# Altium schematic sheet Voeding.SchDoc
size A4; SheetNumber: 5; SheetTotal: 5
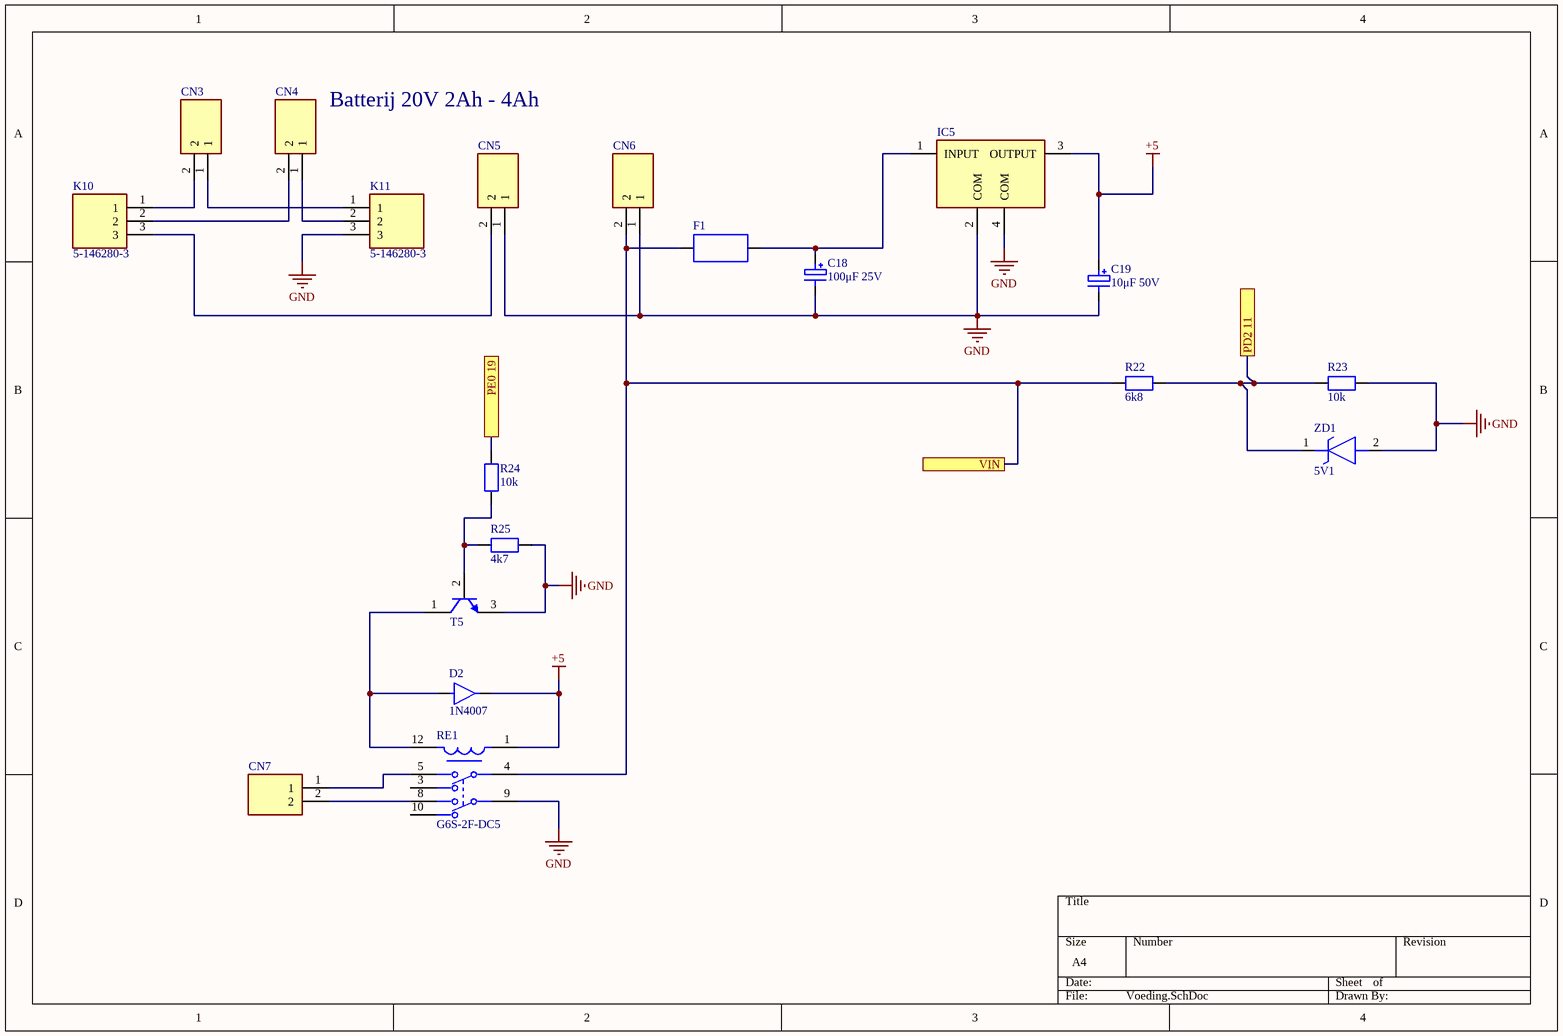
[diagram p0: Voeding.SchDoc]

## Parts
C18  100μF 25V  [Elco 100uF 25V]
C19  10μF 50V  [Elco 100uF 25V]
CN3  282836-2  [Schroefconnector 2 Pin]  (value not drawn)
CN4  282836-2  [Schroefconnector 2 Pin]  (value not drawn)
CN5  282836-2  [Schroefconnector 2 Pin]  (value not drawn)
CN6  282836-2  [Schroefconnector 2 Pin]  (value not drawn)
CN7  282836-2  [Schroefconnector 2 Pin]  (value not drawn)
D2  1N4007  [1N4007]
F1  696101000002  [FuseHolder]  (value not drawn)
IC5  TL780-05CKTTR  [DC-DC Convertor]  (value not drawn)
K10  5-146280-3  [3 Pin Header]
K11  5-146280-3  [3 Pin Header]
R22  6k8  [Resistor]
R23  10k  [Resistor]
R24  10k  [Resistor]
R25  4k7  [Resistor]
RE1  G6S-2F-DC5  [Relay]
T5  BC547CZL1G  [BC547C]  (value not drawn)
ZD1  5V1  [ZenerDiode]

## Ports
PD2 11 (see CPU[3B]), PE0 19 (see CPU[1B]), VIN (see Regelaar[2A])

## Nets
+5: C19.1 D2.1(C) IC5.3(OUTPUT) RE1.1
GND: C18.2 C19.2 CN5.1 CN6.1 IC5.2(COM) IC5.4(COM) K11.3 R23.2 R25.2 RE1.9 T5.3(E) ZD1.2(A)
PD2 11: R22.2 R23.1 ZD1.1(K) ; port PD2 11
PE0 19: R24.2 ; port PE0 19
VIN: CN6.2 F1.1 R22.1 RE1.4 ; port VIN
NetC18_1: C18.1 F1.2 IC5.1(INPUT)
NetCN3_1: CN3.1 K11.1
NetCN3_2: CN3.2 K10.1
NetCN4_1: CN4.1 K11.2
NetCN4_2: CN4.2 K10.2
NetCN5_2: CN5.2 K10.3
NetCN7_1: CN7.1 RE1.5
NetCN7_2: CN7.2 RE1.8
NetD2_2: D2.2(A) RE1.12 T5.1(C)
NetR24_1: R24.1 R25.1 T5.2(B)

Not connected (* = marked no-connect by the designer): RE1 3 10

## Notes on the sheet
- (near CN4) Batterij 20V 2Ah - 4Ah

## Library data of the parts
C18 C19 = Condensator Elco: Part Number: 02015A270JAT2A; Manufacturer: AVX Interconnect / Elco
CN3-CN7 = Schroefconnector 2 Pin L: Connector; Manufacturer_Name: TE Connectivity; Datasheet Link: https://www.te.com/commerce/DocumentDelivery/DDEController?Action=showdoc&DocId=Customer+Drawing%7F282836%7FJ%7Fpdf%7FEnglish%7FENG_CD_282836_J.pdf%7F282836-2; Height: 10mm; Manufacturer_Part_Number: 282836-2
D2 = 1N4007: 1000 V, 1 A; Reverse Voltage: 100V; Forward Voltage: 1V; Output Current: 200mA; Max Power Dissipation: 500mW; Max Reverse Current: 5uA; Forward Current: 300mA; Current: 4A; Reverse Recovery Time: 4ns; Element Configuration: Single; Outside Diameter: 1.85mm; Capacitance: 4pF; Polarity: Standard; Max Forward Surge Current (Ifsm): 1A; Average Rectified Current: 200mA; Diameter: 1.91mm; Max Repetitive Reverse Voltage (Vrrm): 100V; Current Rating: 200mA; Case/Package: DO-35; Lead Free: Lead Free; Number of Pins: 2; Recovery Time: 4ns; Packaging: Bulk; Contact Plating: Tin; Voltage: 100V; Mount: Through Hole; Max Surge Current: 4A; Package Quantity: 2000; Width: 1.91mm; Max Reverse Voltage (DC): 100V; Length: 4.56mm; Radiation Hardening: No; Power Dissipation: 500mW; Voltage Rating (DC): 100V; Peak Non-Repetitive Surge Current: 4A; REACH SVHC: No SVHC; Height: 4.56mm; Max Operating Temperature: 175°C; Series: -; Weight: 0.01lb; Min Operating Temperature: -65°C
F1 = FuseHolder: NexarPartId: 56808803; Fuse Current: 10A; Voltage Rating (AC): 250V; RoHS: Non-Compliant; Max Operating Temperature: 120°C; Min Operating Temperature: -30°C; Mount: Through Hole; Packaging: Box; Height: 13.6mm; REACH SVHC: Unknown
IC5 = DC/DC Convertor: IC REG LIN 5V 1.5A DDPAK/TO263-3; Max Input Voltage: 25V; Number of Outputs: 1; Dropout Voltage: 2V; Polarity: Positive; Output Type: Fixed; Quiescent Current: 8mA; Min Input Voltage: 7V; Power Supply Rejection Ratio (PSRR): 85dB; Accuracy: 1%; Lead Free: Lead Free; Min Operating Temperature: 0°C; Number of Pins: 3; Max Output Voltage: 5V; Case/Package: TO-263; Number of Regulators: 1; Packaging: Tape and Reel; Max Operating Temperature: 125°C; Max Output Current: 1.5A; Nominal Output Voltage: 5V; Height: 4.83mm; Mount: Surface Mount; Weight: 0.050897oz; Output Current: 1.5A; Width: 9.65mm; Output Voltage: 5V; Length: 10.67mm; REACH SVHC: No SVHC; Output Voltage Accuracy: 1%; Package Quantity: 1
K10 K11 = 3 Pin Header: Connector 5-146280-3; Manufacturer_Name: TE Connectivity; Datasheet Link: https://componentsearchengine.com//5-146280-3.pdf; Height: 8.21mm; Mouser2 Part Number: 571-5-146280-3; Mouser2 Price/Stock: https://www.mouser.com/Search/Refine.aspx?Keyword=571-5-146280-3; Manufacturer_Part_Number: 5-146280-3
R22-R25 = Resistor: Manufacturer: Vishay Dale; Part Number: CRCW08050000Z0EA
RE1 = Relay: RELAY TELECOM DPDT 2A 5VDC; Manufacturer: Omron; Coil Resistance: 178Ω; Coil Current: 28.1mA; Coil Voltage: 5V; Standoff Height: 0.35mm; Coil Power: 140mW; Coil Type: Non-Latching; Number Of Contacts: 2; RoHS: TRUE; Device Class L3: Signal Relays; Ambient Temperature Range Low: -40°C; Switching Current: 2A; Device Class L1: Electromechanical; Lead Free: Yes; Category: Relay; Digikey Description: RELAY TELECOM DPDT 2A 5VDC; Height: 9.4mm; Temperature: -40°C to +85°C; Throw Configuration: DPDT; Octopart: https://octopart.com/g6s-2f-dc5-omron-85236; Package: G6S-2F-DC5; Temperature Range High: +85°C; Automotive: No; Current Rating: 2A; Manufacturer Part Number: G6S-2F-DC5; Mouser Description: Electromechanical Relay 5VDC 178Ohm 2A DPDT (14.8x9.2x9.2)mm SMD Signal Relay; Temperature Range Low: -40°C; Device Class L2: Relays; Ambient Temperature Range High: +85°C; ComponentLink2URL: https://omronfs.omron.com/en_US/ecb/products/pdf/en-g6s.pdf; ComponentLink2Description: Datasheet
T5 = BC547C: BC547C, 45 V, 100 mA, 500 mW, / hfe = 400; Manufacturer: On Semiconductor; IC Continuous (A): 0.1; Packing: Ammo Box; Polarity: NPN; fT Min (MHz): 150; PackageDescription: 3-Pin Transistor Outline, Body 4.825 x 3.685 mm, Pitch 1.27 mm; ComponentLink2Description: Datasheet; PackageVersion: Rev. AM; DatasheetVersion: Rev. 7; Mounting Technology: Through Hole; ComponentLink3Description: Package Specification; PartNumber: BC547CZL1G; ComponentLink1Description: Manufacturer URL; PackageReference: TO-92-3-29-11_AM_BL; ComponentLink1URL: http://www.onsemi.com/; RoHS: TRUE; ComponentLink3URL: http://www.onsemi.com/pub_link/Collateral/MAC97-D.PDF; ComponentLink2URL: http://www.onsemi.com/pub_link/Collateral/BC546-D.PDF
ZD1 = ZenerDiode: zenerdiode 5,1 V, 500 mW